# EAGLE design v2.0_r1 (EAGLE 9.6.2)
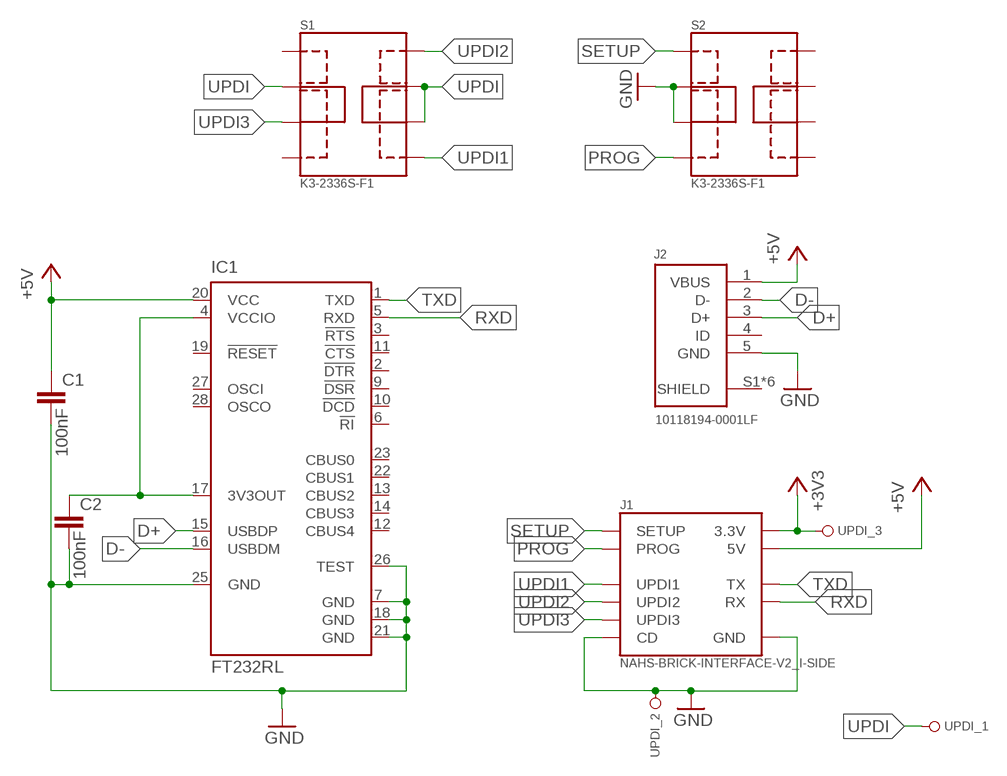
[diagram p0: schematic, sheet 1]

## Parts
C1  100nF  C-EUC0805  [C0805]
C2  100nF  C-EUC0805  [C0805]
IC1  FT232RL  [SSOP28]
J1  NAHS-BRICK-INTERFACE-V2_I-SIDE  [54102-0164]
J2  10118194-0001LF  [10118194-0001LF]
S1  K3-2336S-F1  [K3-2336S-F1]
S2  K3-2336S-F1  [K3-2336S-F1]
UPDI  PINHD_1X03_R_1  [1X03_R_1]

## Nets
+3V3: J1.9(3.3V) UPDI.3
+5V: C1.1 IC1.20(VCC) J1.1(5V) J1.2(5V) J1.3(5V) J2.1(VBUS)
D+: IC1.15(USBDP) J2.3(D+)
D-: IC1.16(USBDM) J2.2(D-)
GND: C1.2 C2.2 IC1.7(GND) IC1.18(GND) IC1.21(GND) IC1.25(GND) IC1.26(TEST) J1.13(CD) J1.14(GND) J1.15(GND) J1.16(GND) J2.5(GND) S2.1.2 S2.1.3 UPDI.2
N$1: C2.1 IC1.4(VCCIO) IC1.17(3V3OUT)
PROG: J1.7(PROG) S2.1.4
RXD: IC1.5(RXD) J1.5(RX)
SETUP: J1.8(SETUP) S2.1.1
TXD: IC1.1(TXD) J1.6(TX)
UPDI: S1.1.2 S1.2.2 S1.2.3 UPDI.1
UPDI1: J1.10(UPDI1) S1.2.4
UPDI2: J1.11(UPDI2) S1.2.1
UPDI3: J1.12(UPDI3) S1.1.3
Unconnected: IC1.2(!DTR) IC1.3(!RTS) IC1.6(!RI) IC1.9(!DSR) IC1.10(!DCD) IC1.11(!CTS) IC1.12(CBUS4) IC1.13(CBUS2) IC1.14(CBUS3) IC1.19(!RESET) IC1.22(CBUS1) IC1.23(CBUS0) IC1.27(OSCI) IC1.28(OSCO) J2.4(ID) S1.1.1 S1.1.4 S2.2.1 S2.2.2 S2.2.3 S2.2.4

## Power pins joined to a net without a drawn wire
SHIELD: J2.S1(SHIELD) J2.S2(SHIELD) J2.S3(SHIELD) J2.S4(SHIELD) J2.S5(SHIELD) J2.S6(SHIELD)

## Library data of the parts
C1 C2 = rcl:C-EU: CAPACITOR, European symbol; SPICEPREFIX: C
IC1 = ftdichip:FT232R: Source: http://www.ftdichip.com/Documents/DataSheets/DS_FT232R_v104.pdf; MPN: FT232RL; OC_FARNELL: 1146032; OC_NEWARK: 91K9918
J1 = no_molex:NAHS-BRICK-INTERFACE-V2
J2 = no_reichelt:10118194-0001LF: CONN RCPT USB2.0 MICRO B SMD R/A Manufacturer's datasheet <https://www.amphenol-icc.com/media/wysiwyg/files/drawing/10118194.pdf?__cf_chl_jschl_tk__=1e9b4569481076e99900b246ea640525553a7b60-1588047333-0-AZhEk6D50lwOf6CdaXmV1teudqMKHMxqtb1pEtnUtu77sOc-OVRjbCmHdORomVnr0W49D2E8XkcMdJ2SdWt5rDDYIblyJz7fSv-zilM8vQKAQDC1Z9aMVORhnMgYjPDuz8XpfDLul_eaqqFpemo1xIgoZv50WTuLMwu26ci7e02s9PWvR3z1cDqm9GMGYIPwIUd9yh5-TtN_o6DbEkadC7zoJlhYZSw-VEaYzfWnBSFg_n44fbEB3slHLR2YKLSiTmh8RSwpxKUP4gER0KeVoie9w-Ibtx3oKQbsZjrsPLGSu9BzV2nf3QeoErALCQuycvY9WhQdebLIpxaon6SXufpVIIdoKZHRpjuVVlAkUIr9oSIZGQzzOWY1-dWY48jVEOvnvoxw9-xup5uFcr7XWo0>; CREATED_BY: PCBLayout.com; DIGIKEY_PARTNO: 609-4618-2-ND; MANUFACTURER: Amphenol ICC (FCI); MPN: 10118194-0001LF
S1 S2 = no_reichelt:K3-2336S-F1
UPDI = no_pinhd:PINHD_1X03; DRILL: 1mm; PADSHAPE: round

## Board
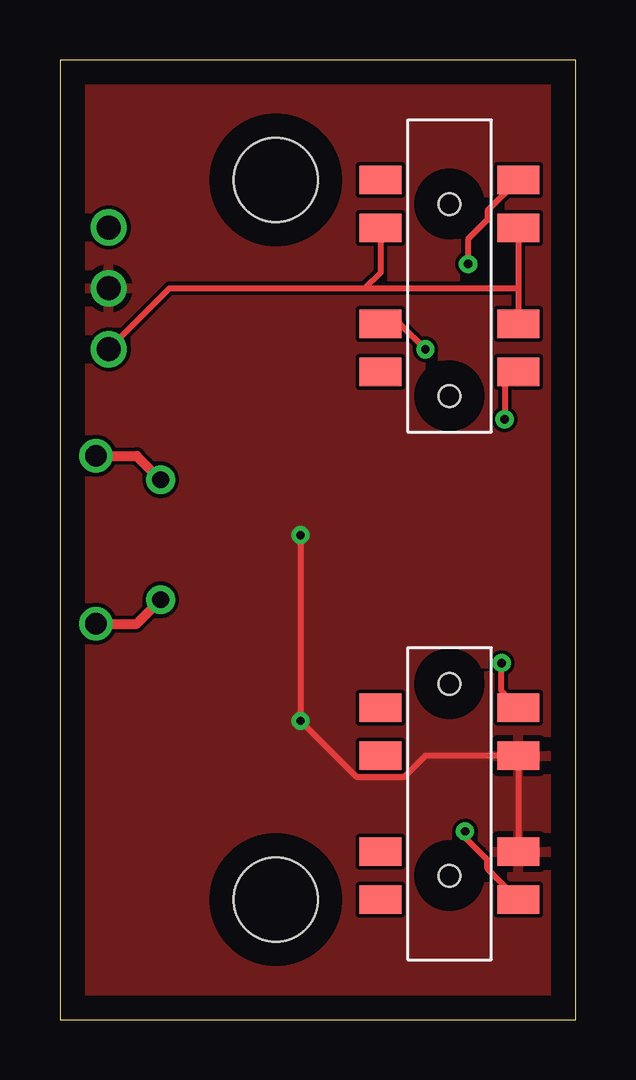
[diagram p1: board, top side]
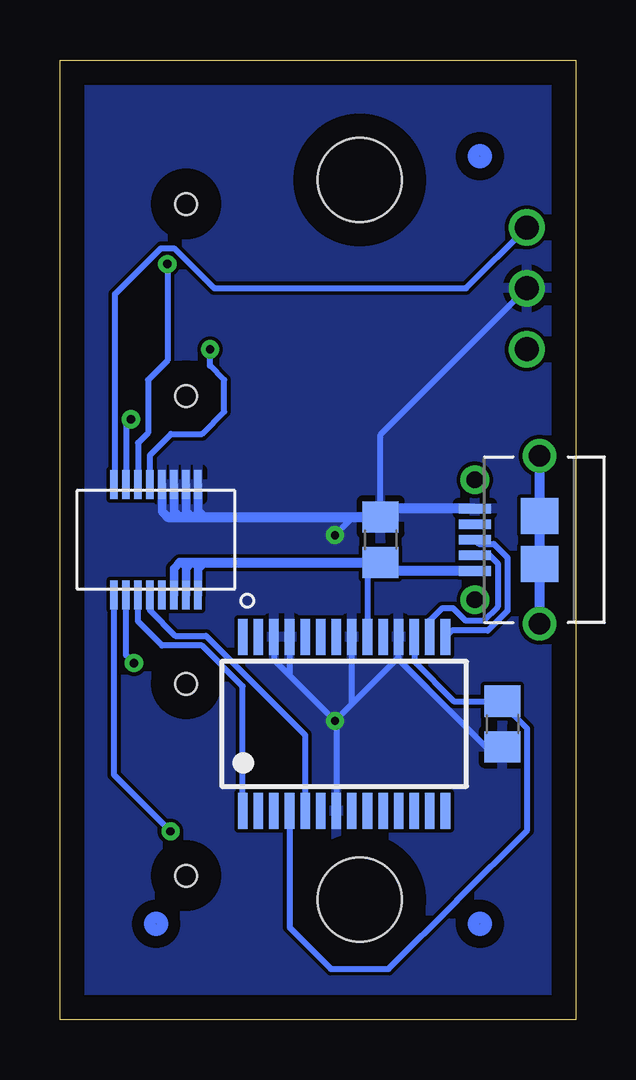
[diagram p2: board, bottom side, seen from below]

Size 21.5 x 40 mm. Coordinates in mm from the lower left corner, seen from the top.
Outline: 0,0 21.5,0 21.5,40 0,40 0,0
Copper layers (1*16): Top 0.035mm / dielectric 1.5mm / Bottom 0.035mm
Design rules "JLCPCB": minimum track width 6mil, minimum drill 0.3mm, track to track 6mil, track to pad 6mil, pad to pad 6mil, via to via 6mil, smd to smd 6mil, copper to edge 40mil, drill to drill 8mil, minimum pad ring 10mil, minimum via ring 8mil, stop-mask expansion 4mil, vias tented up to drill 0mil, thermal gap 10mil
Holes 3.5 mm at 9,5 9,35

### Footprints (pad centres in the part's own frame; a part is rotated, then mirrored left to right if it is on the bottom)
C0805 = smd 1.3 x 1.5: 1 -0.95,0; 2 0.95,0
SSOP28 = smd 0.4 x 1.5: 1 -4.225,-3.625; 2 -3.575,-3.625; 3 -2.925,-3.625; 4 -2.275,-3.625; 5 -1.625,-3.625; 6 -0.975,-3.625; 7 -0.325,-3.625; 8 0.325,-3.625; 9 0.975,-3.625; 10 1.625,-3.625; 11 2.275,-3.625; 12 2.925,-3.625; 13 3.575,-3.625; 14 4.225,-3.625; 15 4.225,3.625; 16 3.575,3.625; 17 2.925,3.625; 18 2.275,3.625; 19 1.625,3.625; 20 0.975,3.625; 21 0.325,3.625; 22 -0.325,3.625; 23 -0.975,3.625; 24 -1.625,3.625; 25 -2.275,3.625; 26 -2.925,3.625; 27 -3.575,3.625; 28 -4.225,3.625
54102-0164 = smd 0.3 x 1.2: 1 1.75,-2.3; 2 1.25,-2.3; 3 0.75,-2.3; 4 0.25,-2.3; 5 -0.25,-2.3; 6 -0.75,-2.3; 7 -1.25,-2.3; 8 -1.75,-2.3; 9 -1.75,2.3; 10 -1.25,2.3; 11 -0.75,2.3; 12 -0.25,2.3; 13 0.25,2.3; 14 0.75,2.3; 15 1.25,2.3; 16 1.75,2.3
10118194-0001LF = smd 0.4 x 1.35: 1 -1.3,2.7; 2 -0.65,2.7; 3 0,2.7; 4 0.65,2.7; 5 1.3,2.7 | drill 0.7: S1 -2.5,2.7; S2 2.5,2.7 | drill 0.9: S3 -3.5,0; S6 3.5,0 | smd 1.5 x 1.55: S4 -1,0; S5 1,0
K3-2336S-F1 = smd 1.2 x 1.75: 1.1 -4,-2.875; 1.2 -2,-2.875; 1.3 2,-2.875; 1.4 4,-2.875; 2.1 -4,2.875; 2.2 -2,2.875; 2.3 2,2.875; 2.4 4,2.875 | hole 0.9: -3,0; 5,0
1X03_R_1 = drill 1: 1 0,0; 2 2.54,0; 3 5.08,0

### Placement (x,y rotation side)
C1  8.13,20 90 bottom
C2  3.05,12.32 270 bottom
IC1  9.65,12.32 0 bottom
J1  17.5,20 0 bottom
J2  1.5,20 90 bottom
S1  16.24,31 270 top
S2  16.24,9 90 top
U$1  [FIDUCIAL]  4,36 0 bottom
U$2  [FIDUCIAL]  4,4 0 bottom
U$3  [FIDUCIAL]  17.5,4 0 bottom
UPDI  2.03,27.94 90 top

### Tracks (layer width: path | path; a pad name or v marks a point on that pad's centre or on a via)
+3V3
  Bottom 0.254: J1.9 19.2,22.35 19.2,30.24 17.29,32.15 16.75,32.15 15.07,30.48 4.57,30.48 UPDI.3
+5V
  Bottom 0.254: IC1.20 8.68,18.5 C1.1
  Bottom 0.356: J1.3 16.75,18.81 16.51,19.05 | J1.2 16.25,18.8 16,19.05 | J1.1 15.75,18.79 15.49,19.05
  Bottom 0.406: J2.1 7.78,18.7 C1.1 15.49,19.05 16,19.05 16.51,19.05
D+
  Bottom 0.254: J2.3 4.03,19.83 3.41,19.83 2.84,19.26 2.84,17.04 3.67,16.21 5.16,16.21 IC1.15
D-
  Bottom 0.254: IC1.16 6.08,16.64 5.57,17.14 5.09,17.14 4.57,16.62 3.83,16.62 3.25,17.2 3.25,19.02 3.58,19.35 J2.2
GND  (via drill 0.35)
  Top 0.254: S2.1.2 S2.1.3 15.23,11 14.36,10.12 12.36,10.12 v10.03,12.45 v10.03,20.19
  Bottom 0.254: UPDI.2 8.13,24.38 C1.2 9.28,20.95 v10.03,20.19 | v10.03,12.45 11.93,14.34 | 11.93,14.34 12.58,14.99 IC1.26 | IC1.25 11.93,14.34 | v10.03,12.45 7.43,15.05 | 7.43,15.05 7.38,15.1 IC1.18 | v10.03,12.45 9.33,13.15 IC1.21 | v10.03,12.45 9.98,12.39 IC1.7 | C2.2 3.75,11.37 7.43,15.05
  Bottom 0.356: J1.13 17.25,21.19 17.01,20.95 | J1.14 16.75,21.19 16.51,20.95 | J1.15 16.25,21.2 16,20.95 | J1.16 15.75,21.21 15.49,20.95
  Bottom 0.406: J2.5 7.78,21.3 C1.2 15.49,20.95 16,20.95 16.51,20.95 17.01,20.95
  pour Bottom: 0,0 21.5,0 21.5,40 0,40
  pour Top: 0,0 21.5,0 21.5,40 0,40
N$1
  Bottom 0.254: IC1.4 11.93,3.84 10.2,2.11 7.8,2.11 4.95,4.95 4.95,4.96 2.02,7.89 2.02,12.13 3.05,13.16 C2.1 5.07,13.27 6.73,14.92 IC1.17
PROG  (via drill 0.35)
  Top 0.254: S2.1.4 18.41,13.7 v18.41,14.86
  Bottom 0.254: v18.41,14.86 18.75,15.19 J1.7
RXD
  Bottom 0.254: IC1.5 11.28,11.87 15.41,16 16.7,16 17.75,17.05 J1.5
SETUP  (via drill 0.35)
  Top 0.254: S2.1.1 17.83,6.28 17.83,6.66 16.89,7.6 v16.89,7.84
  Bottom 0.254: v16.89,7.84 19.25,10.2 J1.8
SHIELD
  Top 0.406: J2.S6 3.2,23.5 J2.S2 | J2.S3 3.2,16.5 J2.S1
  Bottom 0.406: J2.S3 J2.S4 J2.S5 J2.S6
TXD
  Bottom 0.254: IC1.1 13.88,13.89 15.58,15.59 17.24,15.59 18.25,16.6 J1.6
UPDI
  Top 0.254: S1.2.2 19.11,30.48 | 19.11,30.48 S1.2.3 | UPDI.1 4.57,30.48 12.7,30.48 | 12.7,30.48 19.11,30.48 | S1.1.2 13.37,31.14 12.7,30.48
UPDI1  (via drill 0.35)
  Top 0.254: S1.2.4 18.54,26.43 v18.54,25.02
  Bottom 0.254: v18.54,25.02 18.75,24.81 J1.10
UPDI2  (via drill 0.35)
  Top 0.254: S1.2.1 17.83,33.72 17.83,33.34 17.02,32.52 v17.02,31.5
  Bottom 0.254: v17.02,31.5 17.02,27.48 17.83,26.66 17.83,24.46 18.25,24.04 J1.11
UPDI3  (via drill 0.35)
  Top 0.254: v15.24,27.94 14.18,29 S1.1.3
  Bottom 0.254: J1.12 17.75,23.52 16.87,24.41 15.58,24.41 14.65,25.34 14.65,26.66 15.24,27.25 v15.24,27.94

### Text on the board
tDocu: U2 | + | by NiJO's | - | U | U1 | NAHS-Brick-Interface | P | B | v2.0 R1 | S